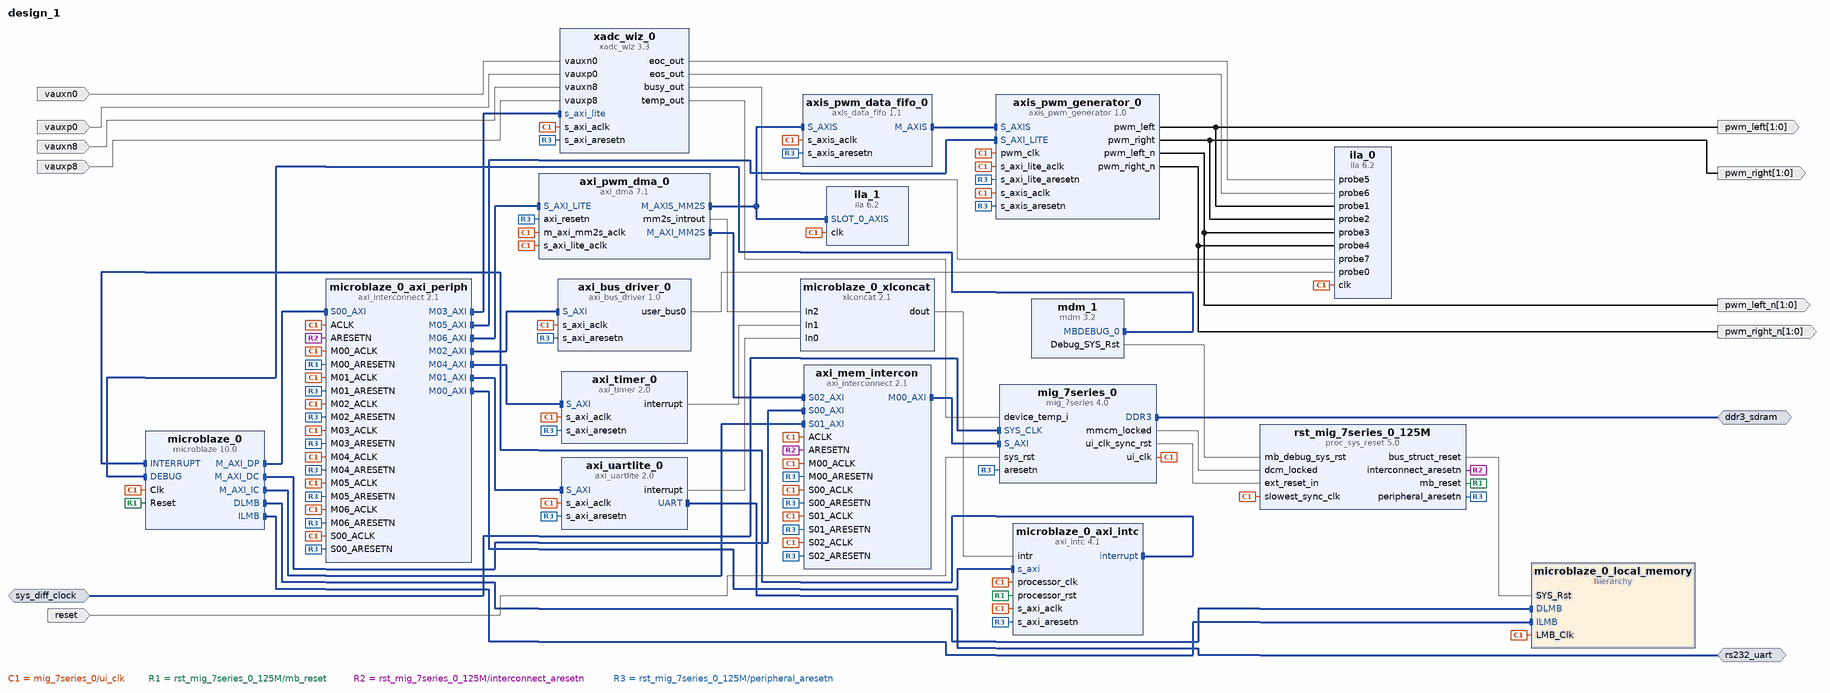
[diagram p0: block diagram of the top level]
# Vivado block design design_1, xc7vx485tffg1761-2, Vivado 2016.4
create_bd_design design_1

create_bd_intf_port -mode Master -vlnv xilinx.com:interface:ddrx_rtl:1.0 ddr3_sdram
create_bd_intf_port -mode Slave -vlnv xilinx.com:interface:diff_clock_rtl:1.0 sys_diff_clock
set_property -dict {CONFIG.FREQ_HZ 100000000} [get_bd_intf_ports sys_diff_clock]
create_bd_intf_port -mode Master -vlnv xilinx.com:interface:uart_rtl:1.0 rs232_uart
create_bd_port -dir I -type rst reset
set_property -dict {CONFIG.POLARITY ACTIVE_HIGH} [get_bd_ports reset]
create_bd_port -dir I vauxn0
create_bd_port -dir I vauxp0
create_bd_port -dir I vauxn8
create_bd_port -dir I vauxp8
create_bd_port -dir O -from 1 -to 0 pwm_left
create_bd_port -dir O -from 1 -to 0 pwm_right
create_bd_port -dir O -from 1 -to 0 pwm_left_n
create_bd_port -dir O -from 1 -to 0 pwm_right_n

create_bd_cell -type ip -vlnv xilinx.com:ip:mig_7series:4.0 mig_7series_0
set_property -dict [list \
  CONFIG.XML_INPUT_FILE mig_a.prj \
  CONFIG.RESET_BOARD_INTERFACE reset \
  CONFIG.BOARD_MIG_PARAM ddr3_sdram \
] [get_bd_cells mig_7series_0]
create_bd_cell -type ip -vlnv xilinx.com:ip:microblaze:10.0 microblaze_0
set_property -dict [list \
  CONFIG.C_D_AXI 1 \
  CONFIG.C_D_LMB 1 \
  CONFIG.C_I_LMB 1 \
  CONFIG.G_TEMPLATE_LIST 4 \
  CONFIG.G_USE_EXCEPTIONS 1 \
  CONFIG.C_USE_MSR_INSTR 1 \
  CONFIG.C_USE_PCMP_INSTR 1 \
  CONFIG.C_USE_BARREL 1 \
  CONFIG.C_USE_DIV 1 \
  CONFIG.C_USE_HW_MUL 2 \
  CONFIG.C_UNALIGNED_EXCEPTIONS 1 \
  CONFIG.C_ILL_OPCODE_EXCEPTION 1 \
  CONFIG.C_M_AXI_I_BUS_EXCEPTION 1 \
  CONFIG.C_M_AXI_D_BUS_EXCEPTION 1 \
  CONFIG.C_DIV_ZERO_EXCEPTION 1 \
  CONFIG.C_PVR 2 \
  CONFIG.C_DEBUG_ENABLED 1 \
  CONFIG.C_OPCODE_0x0_ILLEGAL 1 \
  CONFIG.C_USE_ICACHE 1 \
  CONFIG.C_CACHE_BYTE_SIZE 32768 \
  CONFIG.C_ICACHE_LINE_LEN 8 \
  CONFIG.C_ICACHE_VICTIMS 8 \
  CONFIG.C_ICACHE_STREAMS 1 \
  CONFIG.C_USE_DCACHE 1 \
  CONFIG.C_DCACHE_BYTE_SIZE 32768 \
  CONFIG.C_USE_MMU 3 \
  CONFIG.C_MMU_ZONES 2 \
] [get_bd_cells microblaze_0]
create_bd_cell -type hier microblaze_0_local_memory
create_bd_cell -type ip -vlnv xilinx.com:ip:axi_interconnect:2.1 microblaze_0_axi_periph
set_property -dict {CONFIG.NUM_MI 7} [get_bd_cells microblaze_0_axi_periph]
create_bd_cell -type ip -vlnv xilinx.com:ip:axi_intc:4.1 microblaze_0_axi_intc
set_property -dict {CONFIG.C_HAS_FAST 1} [get_bd_cells microblaze_0_axi_intc]
create_bd_cell -type ip -vlnv xilinx.com:ip:xlconcat:2.1 microblaze_0_xlconcat
set_property -dict {CONFIG.NUM_PORTS 3} [get_bd_cells microblaze_0_xlconcat]
create_bd_cell -type ip -vlnv xilinx.com:ip:mdm:3.2 mdm_1
create_bd_cell -type ip -vlnv xilinx.com:ip:proc_sys_reset:5.0 rst_mig_7series_0_125M
create_bd_cell -type ip -vlnv xilinx.com:ip:axi_interconnect:2.1 axi_mem_intercon
set_property -dict {CONFIG.NUM_SI 3 CONFIG.NUM_MI 1} [get_bd_cells axi_mem_intercon]
create_bd_cell -type ip -vlnv xilinx.com:ip:axi_uartlite:2.0 axi_uartlite_0
set_property -dict [list \
  CONFIG.C_BAUDRATE 115200 \
  CONFIG.USE_BOARD_FLOW true \
  CONFIG.UARTLITE_BOARD_INTERFACE rs232_uart \
] [get_bd_cells axi_uartlite_0]
create_bd_cell -type ip -vlnv xilinx.com:ip:ila:6.2 ila_0
set_property -dict [list \
  CONFIG.C_PROBE5_WIDTH 1 \
  CONFIG.C_PROBE4_WIDTH 2 \
  CONFIG.C_PROBE3_WIDTH 2 \
  CONFIG.C_PROBE2_WIDTH 2 \
  CONFIG.C_PROBE1_WIDTH 2 \
  CONFIG.C_PROBE0_WIDTH 32 \
  CONFIG.C_DATA_DEPTH 131072 \
  CONFIG.C_NUM_OF_PROBES 8 \
  CONFIG.C_ENABLE_ILA_AXI_MON false \
  CONFIG.C_MONITOR_TYPE Native \
] [get_bd_cells ila_0]
create_bd_cell -type ip -vlnv xilinx.com:ip:xadc_wiz:3.3 xadc_wiz_0
set_property -dict [list \
  CONFIG.XADC_STARUP_SELECTION simultaneous_sampling \
  CONFIG.DCLK_FREQUENCY 125 \
  CONFIG.ADC_CONVERSION_RATE 1000 \
  CONFIG.SEQUENCER_MODE Off \
  CONFIG.OT_ALARM false \
  CONFIG.USER_TEMP_ALARM false \
  CONFIG.VCCINT_ALARM false \
  CONFIG.VCCAUX_ALARM false \
  CONFIG.CHANNEL_AVERAGING 16 \
  CONFIG.CHANNEL_ENABLE_TEMPERATURE true \
  CONFIG.CHANNEL_ENABLE_VP_VN false \
  CONFIG.CHANNEL_ENABLE_VAUXP0_VAUXN0 true \
  CONFIG.CHANNEL_ENABLE_VAUXP8_VAUXN8 true \
  CONFIG.AVERAGE_ENABLE_TEMPERATURE true \
  CONFIG.BIPOLAR_VAUXP0_VAUXN0 true \
  CONFIG.BIPOLAR_VAUXP8_VAUXN8 true \
  CONFIG.ENABLE_TEMP_BUS true \
] [get_bd_cells xadc_wiz_0]
create_bd_cell -type ip -vlnv xilinx.com:ip:axi_timer:2.0 axi_timer_0
create_bd_cell -type ip -vlnv xilinx.com:ip:axi_dma:7.1 axi_pwm_dma_0
set_property -dict [list \
  CONFIG.c_include_sg 0 \
  CONFIG.c_sg_length_width 23 \
  CONFIG.c_micro_dma 0 \
  CONFIG.c_include_mm2s 1 \
  CONFIG.c_m_axis_mm2s_tdata_width 32 \
  CONFIG.c_include_mm2s_dre 0 \
  CONFIG.c_mm2s_burst_size 256 \
  CONFIG.c_include_s2mm 0 \
] [get_bd_cells axi_pwm_dma_0]
create_bd_cell -type ip -vlnv xilinx.com:ip:axis_data_fifo:1.1 axis_pwm_data_fifo_0
set_property -dict [list \
  CONFIG.TDATA_NUM_BYTES 4 \
  CONFIG.FIFO_MODE 2 \
  CONFIG.HAS_TSTRB 1 \
  CONFIG.HAS_TKEEP 0 \
] [get_bd_cells axis_pwm_data_fifo_0]
create_bd_cell -type ip -vlnv xilinx.com:ip:ila:6.2 ila_1
set_property -dict {CONFIG.C_DATA_DEPTH 131072 CONFIG.C_NUM_OF_PROBES 9 CONFIG.C_SLOT_0_AXI_PROTOCOL AXI4S} [get_bd_cells ila_1]
create_bd_cell -type ip -vlnv xilinx.com:user:axi_bus_driver:1.0 axi_bus_driver_0
create_bd_cell -type ip -vlnv xilinx.com:user:axis_pwm_generator:1.0 axis_pwm_generator_0

# ---- hierarchy /microblaze_0_local_memory ----
current_bd_instance /microblaze_0_local_memory
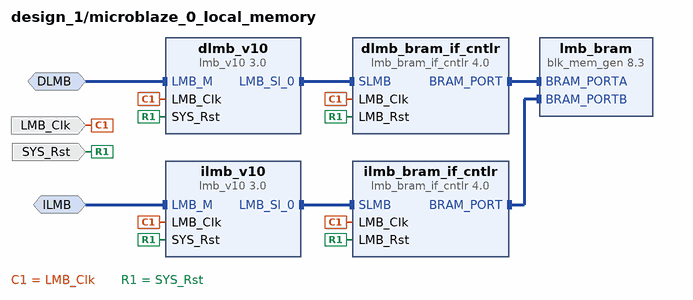
[diagram p1: block diagram inside /microblaze_0_local_memory]
create_bd_intf_pin -mode MirroredMaster -vlnv xilinx.com:interface:lmb_rtl:1.0 DLMB
create_bd_intf_pin -mode MirroredMaster -vlnv xilinx.com:interface:lmb_rtl:1.0 ILMB
create_bd_pin -dir I -type clk LMB_Clk
create_bd_pin -dir I -type rst SYS_Rst

create_bd_cell -type ip -vlnv xilinx.com:ip:lmb_v10:3.0 dlmb_v10
create_bd_cell -type ip -vlnv xilinx.com:ip:lmb_v10:3.0 ilmb_v10
create_bd_cell -type ip -vlnv xilinx.com:ip:lmb_bram_if_cntlr:4.0 dlmb_bram_if_cntlr
set_property -dict {CONFIG.C_ECC 0} [get_bd_cells dlmb_bram_if_cntlr]
create_bd_cell -type ip -vlnv xilinx.com:ip:lmb_bram_if_cntlr:4.0 ilmb_bram_if_cntlr
set_property -dict {CONFIG.C_ECC 0} [get_bd_cells ilmb_bram_if_cntlr]
create_bd_cell -type ip -vlnv xilinx.com:ip:blk_mem_gen:8.3 lmb_bram
set_property -dict {CONFIG.Memory_Type True_Dual_Port_RAM CONFIG.use_bram_block BRAM_Controller} [get_bd_cells lmb_bram]

# ---- connections ----

current_bd_instance /microblaze_0_local_memory
connect_bd_intf_net -intf_net microblaze_0_dlmb_bus [get_bd_intf_pins dlmb_v10/LMB_Sl_0] [get_bd_intf_pins dlmb_bram_if_cntlr/SLMB]
connect_bd_intf_net -intf_net microblaze_0_ilmb_bus [get_bd_intf_pins ilmb_v10/LMB_Sl_0] [get_bd_intf_pins ilmb_bram_if_cntlr/SLMB]
connect_bd_intf_net -intf_net microblaze_0_dlmb_cntlr [get_bd_intf_pins dlmb_bram_if_cntlr/BRAM_PORT] [get_bd_intf_pins lmb_bram/BRAM_PORTA]
connect_bd_intf_net -intf_net microblaze_0_ilmb_cntlr [get_bd_intf_pins ilmb_bram_if_cntlr/BRAM_PORT] [get_bd_intf_pins lmb_bram/BRAM_PORTB]
connect_bd_intf_net -intf_net microblaze_0_dlmb [get_bd_intf_pins DLMB] [get_bd_intf_pins dlmb_v10/LMB_M]
connect_bd_intf_net -intf_net microblaze_0_ilmb [get_bd_intf_pins ILMB] [get_bd_intf_pins ilmb_v10/LMB_M]
connect_bd_net -net microblaze_0_Clk [get_bd_pins LMB_Clk] \
  [get_bd_pins dlmb_v10/LMB_Clk] [get_bd_pins dlmb_bram_if_cntlr/LMB_Clk] [get_bd_pins ilmb_v10/LMB_Clk] \
  [get_bd_pins ilmb_bram_if_cntlr/LMB_Clk]
connect_bd_net [get_bd_pins SYS_Rst] \
  [get_bd_pins dlmb_v10/SYS_Rst] [get_bd_pins dlmb_bram_if_cntlr/LMB_Rst] [get_bd_pins ilmb_v10/SYS_Rst] \
  [get_bd_pins ilmb_bram_if_cntlr/LMB_Rst]

current_bd_instance /
connect_bd_intf_net [get_bd_intf_pins microblaze_0/DLMB] [get_bd_intf_pins microblaze_0_local_memory/DLMB]
connect_bd_intf_net [get_bd_intf_pins microblaze_0/ILMB] [get_bd_intf_pins microblaze_0_local_memory/ILMB]
connect_bd_intf_net -intf_net microblaze_0_axi_dp [get_bd_intf_pins microblaze_0_axi_periph/S00_AXI] [get_bd_intf_pins microblaze_0/M_AXI_DP]
connect_bd_intf_net [get_bd_intf_pins microblaze_0_axi_intc/interrupt] [get_bd_intf_pins microblaze_0/INTERRUPT]
connect_bd_intf_net -intf_net microblaze_0_intc_axi [get_bd_intf_pins microblaze_0_axi_periph/M00_AXI] [get_bd_intf_pins microblaze_0_axi_intc/s_axi]
connect_bd_intf_net [get_bd_intf_pins mdm_1/MBDEBUG_0] [get_bd_intf_pins microblaze_0/DEBUG]
connect_bd_intf_net [get_bd_intf_pins microblaze_0/M_AXI_DC] [get_bd_intf_pins axi_mem_intercon/S00_AXI]
connect_bd_intf_net [get_bd_intf_pins axi_mem_intercon/M00_AXI] [get_bd_intf_pins mig_7series_0/S_AXI]
connect_bd_intf_net [get_bd_intf_pins microblaze_0/M_AXI_IC] [get_bd_intf_pins axi_mem_intercon/S01_AXI]
connect_bd_intf_net [get_bd_intf_pins microblaze_0_axi_periph/M01_AXI] [get_bd_intf_pins axi_uartlite_0/S_AXI]
connect_bd_intf_net [get_bd_intf_pins microblaze_0_axi_periph/M03_AXI] [get_bd_intf_pins xadc_wiz_0/s_axi_lite]
connect_bd_intf_net [get_bd_intf_pins microblaze_0_axi_periph/M04_AXI] [get_bd_intf_pins axi_timer_0/S_AXI]
connect_bd_intf_net [get_bd_intf_pins microblaze_0_axi_periph/M06_AXI] [get_bd_intf_pins axi_pwm_dma_0/S_AXI_LITE]
connect_bd_intf_net -intf_net axi_dma_0_M_AXI_MM2S [get_bd_intf_pins axi_pwm_dma_0/M_AXI_MM2S] [get_bd_intf_pins axi_mem_intercon/S02_AXI]
connect_bd_intf_net [get_bd_intf_pins microblaze_0_axi_periph/M05_AXI] [get_bd_intf_pins axis_pwm_generator_0/S_AXI_LITE]
connect_bd_intf_net -intf_net axi_dma_0_M_AXIS_MM2S [get_bd_intf_pins axi_pwm_dma_0/M_AXIS_MM2S] [get_bd_intf_pins axis_pwm_data_fifo_0/S_AXIS]
connect_bd_intf_net [get_bd_intf_pins axi_pwm_dma_0/M_AXIS_MM2S] [get_bd_intf_pins ila_1/SLOT_0_AXIS]
connect_bd_intf_net -intf_net axis_data_fifo_0_M_AXIS [get_bd_intf_pins axis_pwm_data_fifo_0/M_AXIS] [get_bd_intf_pins axis_pwm_generator_0/S_AXIS]
connect_bd_intf_net [get_bd_intf_pins microblaze_0_axi_periph/M02_AXI] [get_bd_intf_pins axi_bus_driver_0/S_AXI]
connect_bd_intf_net [get_bd_intf_ports ddr3_sdram] [get_bd_intf_pins mig_7series_0/DDR3]
connect_bd_intf_net [get_bd_intf_ports sys_diff_clock] [get_bd_intf_pins mig_7series_0/SYS_CLK]
connect_bd_intf_net [get_bd_intf_ports rs232_uart] [get_bd_intf_pins axi_uartlite_0/UART]
connect_bd_net -net microblaze_0_intr [get_bd_pins microblaze_0_xlconcat/dout] [get_bd_pins microblaze_0_axi_intc/intr]
connect_bd_net -net microblaze_0_Clk [get_bd_pins mig_7series_0/ui_clk] \
  [get_bd_pins microblaze_0/Clk] [get_bd_pins microblaze_0_axi_intc/s_axi_aclk] \
  [get_bd_pins microblaze_0_axi_intc/processor_clk] [get_bd_pins rst_mig_7series_0_125M/slowest_sync_clk] \
  [get_bd_pins axi_uartlite_0/s_axi_aclk] [get_bd_pins ila_0/clk] [get_bd_pins xadc_wiz_0/s_axi_aclk] \
  [get_bd_pins axi_timer_0/s_axi_aclk] [get_bd_pins axi_pwm_dma_0/s_axi_lite_aclk] \
  [get_bd_pins axi_pwm_dma_0/m_axi_mm2s_aclk] [get_bd_pins axis_pwm_data_fifo_0/s_axis_aclk] [get_bd_pins ila_1/clk] \
  [get_bd_pins axi_bus_driver_0/s_axi_aclk] [get_bd_pins microblaze_0_axi_periph/ACLK] \
  [get_bd_pins microblaze_0_axi_periph/S00_ACLK] [get_bd_pins microblaze_0_axi_periph/M00_ACLK] \
  [get_bd_pins microblaze_0_local_memory/LMB_Clk] [get_bd_pins axi_mem_intercon/S00_ACLK] [get_bd_pins axi_mem_intercon/ACLK] \
  [get_bd_pins axi_mem_intercon/S01_ACLK] [get_bd_pins axi_mem_intercon/M00_ACLK] \
  [get_bd_pins microblaze_0_axi_periph/M01_ACLK] [get_bd_pins microblaze_0_axi_periph/M02_ACLK] \
  [get_bd_pins microblaze_0_axi_periph/M03_ACLK] [get_bd_pins microblaze_0_axi_periph/M04_ACLK] \
  [get_bd_pins microblaze_0_axi_periph/M05_ACLK] [get_bd_pins microblaze_0_axi_periph/M06_ACLK] \
  [get_bd_pins axi_mem_intercon/S02_ACLK] [get_bd_pins axis_pwm_generator_0/pwm_clk] \
  [get_bd_pins axis_pwm_generator_0/s_axi_lite_aclk] [get_bd_pins axis_pwm_generator_0/s_axis_aclk]
connect_bd_net [get_bd_pins mig_7series_0/mmcm_locked] [get_bd_pins rst_mig_7series_0_125M/dcm_locked]
connect_bd_net [get_bd_pins mig_7series_0/ui_clk_sync_rst] [get_bd_pins rst_mig_7series_0_125M/ext_reset_in]
connect_bd_net [get_bd_pins rst_mig_7series_0_125M/mb_reset] [get_bd_pins microblaze_0/Reset] [get_bd_pins microblaze_0_axi_intc/processor_rst]
connect_bd_net [get_bd_pins rst_mig_7series_0_125M/bus_struct_reset] [get_bd_pins microblaze_0_local_memory/SYS_Rst]
connect_bd_net [get_bd_pins rst_mig_7series_0_125M/interconnect_aresetn] \
  [get_bd_pins microblaze_0_axi_periph/ARESETN] [get_bd_pins axi_mem_intercon/ARESETN]
connect_bd_net [get_bd_pins rst_mig_7series_0_125M/peripheral_aresetn] \
  [get_bd_pins microblaze_0_axi_intc/s_axi_aresetn] [get_bd_pins mig_7series_0/aresetn] \
  [get_bd_pins axi_uartlite_0/s_axi_aresetn] [get_bd_pins xadc_wiz_0/s_axi_aresetn] [get_bd_pins axi_timer_0/s_axi_aresetn] \
  [get_bd_pins axi_pwm_dma_0/axi_resetn] [get_bd_pins axis_pwm_data_fifo_0/s_axis_aresetn] \
  [get_bd_pins axi_bus_driver_0/s_axi_aresetn] [get_bd_pins microblaze_0_axi_periph/S00_ARESETN] \
  [get_bd_pins microblaze_0_axi_periph/M00_ARESETN] [get_bd_pins axi_mem_intercon/S00_ARESETN] \
  [get_bd_pins axi_mem_intercon/S01_ARESETN] [get_bd_pins axi_mem_intercon/M00_ARESETN] \
  [get_bd_pins microblaze_0_axi_periph/M01_ARESETN] [get_bd_pins microblaze_0_axi_periph/M02_ARESETN] \
  [get_bd_pins microblaze_0_axi_periph/M03_ARESETN] [get_bd_pins microblaze_0_axi_periph/M04_ARESETN] \
  [get_bd_pins microblaze_0_axi_periph/M05_ARESETN] [get_bd_pins microblaze_0_axi_periph/M06_ARESETN] \
  [get_bd_pins axi_mem_intercon/S02_ARESETN] [get_bd_pins axis_pwm_generator_0/s_axi_lite_aresetn] \
  [get_bd_pins axis_pwm_generator_0/s_axis_aresetn]
connect_bd_net [get_bd_pins mdm_1/Debug_SYS_Rst] [get_bd_pins rst_mig_7series_0_125M/mb_debug_sys_rst]
connect_bd_net [get_bd_ports reset] [get_bd_pins mig_7series_0/sys_rst]
connect_bd_net [get_bd_pins axi_uartlite_0/interrupt] [get_bd_pins microblaze_0_xlconcat/In0]
connect_bd_net -net vauxn0_1 [get_bd_ports vauxn0] [get_bd_pins xadc_wiz_0/vauxn0]
connect_bd_net -net vauxp0_1 [get_bd_ports vauxp0] [get_bd_pins xadc_wiz_0/vauxp0]
connect_bd_net -net vauxn8_1 [get_bd_ports vauxn8] [get_bd_pins xadc_wiz_0/vauxn8]
connect_bd_net -net vauxp8_1 [get_bd_ports vauxp8] [get_bd_pins xadc_wiz_0/vauxp8]
connect_bd_net [get_bd_pins axi_timer_0/interrupt] [get_bd_pins microblaze_0_xlconcat/In1]
connect_bd_net -net pwm_generator_0_pwm_left [get_bd_pins axis_pwm_generator_0/pwm_left] [get_bd_ports pwm_left] [get_bd_pins ila_0/probe1]
connect_bd_net -net pwm_generator_0_pwm_right [get_bd_pins axis_pwm_generator_0/pwm_right] [get_bd_ports pwm_right] [get_bd_pins ila_0/probe2]
connect_bd_net -net pwm_generator_0_pwm_left_n [get_bd_pins axis_pwm_generator_0/pwm_left_n] [get_bd_ports pwm_left_n] [get_bd_pins ila_0/probe3]
connect_bd_net -net pwm_generator_0_pwm_right_n [get_bd_pins axis_pwm_generator_0/pwm_right_n] [get_bd_ports pwm_right_n] [get_bd_pins ila_0/probe4]
connect_bd_net [get_bd_pins xadc_wiz_0/temp_out] [get_bd_pins mig_7series_0/device_temp_i]
connect_bd_net -net axi_dma_0_mm2s_introut [get_bd_pins axi_pwm_dma_0/mm2s_introut] [get_bd_pins microblaze_0_xlconcat/In2]
connect_bd_net [get_bd_pins axi_bus_driver_0/user_bus0] [get_bd_pins ila_0/probe0]
connect_bd_net [get_bd_pins xadc_wiz_0/eoc_out] [get_bd_pins ila_0/probe5]
connect_bd_net [get_bd_pins xadc_wiz_0/eos_out] [get_bd_pins ila_0/probe6]
connect_bd_net [get_bd_pins xadc_wiz_0/busy_out] [get_bd_pins ila_0/probe7]

# ---- address map ----
assign_bd_address -offset 0x80000000 -range 1G -target_address_space [get_bd_addr_spaces axi_pwm_dma_0/Data_MM2S] [get_bd_addr_segs mig_7series_0/memmap/memaddr]
assign_bd_address -offset 0x00000000 -range 32K -target_address_space [get_bd_addr_spaces microblaze_0/Data] [get_bd_addr_segs microblaze_0_local_memory/dlmb_bram_if_cntlr/SLMB/Mem]
assign_bd_address -offset 0x40600000 -range 64K -target_address_space [get_bd_addr_spaces microblaze_0/Data] [get_bd_addr_segs axi_uartlite_0/S_AXI/Reg]
assign_bd_address -offset 0x41200000 -range 64K -target_address_space [get_bd_addr_spaces microblaze_0/Data] [get_bd_addr_segs microblaze_0_axi_intc/S_AXI/Reg]
assign_bd_address -offset 0x41C00000 -range 64K -target_address_space [get_bd_addr_spaces microblaze_0/Data] [get_bd_addr_segs axi_timer_0/S_AXI/Reg]
assign_bd_address -offset 0x41E00000 -range 64K -target_address_space [get_bd_addr_spaces microblaze_0/Data] [get_bd_addr_segs axi_pwm_dma_0/S_AXI_LITE/Reg]
assign_bd_address -offset 0x44A00000 -range 64K -target_address_space [get_bd_addr_spaces microblaze_0/Data] [get_bd_addr_segs axi_bus_driver_0/S_AXI/S_AXI_reg]
assign_bd_address -offset 0x44A10000 -range 64K -target_address_space [get_bd_addr_spaces microblaze_0/Data] [get_bd_addr_segs xadc_wiz_0/s_axi_lite/Reg]
assign_bd_address -offset 0x44A20000 -range 64K -target_address_space [get_bd_addr_spaces microblaze_0/Data] [get_bd_addr_segs axis_pwm_generator_0/S_AXI_LITE/S_AXI_LITE_reg]
assign_bd_address -offset 0x80000000 -range 1G -target_address_space [get_bd_addr_spaces microblaze_0/Data] [get_bd_addr_segs mig_7series_0/memmap/memaddr]
assign_bd_address -offset 0x00000000 -range 32K -target_address_space [get_bd_addr_spaces microblaze_0/Instruction] [get_bd_addr_segs microblaze_0_local_memory/ilmb_bram_if_cntlr/SLMB/Mem]
assign_bd_address -offset 0x80000000 -range 1G -target_address_space [get_bd_addr_spaces microblaze_0/Instruction] [get_bd_addr_segs mig_7series_0/memmap/memaddr]

validate_bd_design
save_bd_design
